# EAGLE schematic NinjaPCB-ver1.0 (EAGLE 6.6.0)
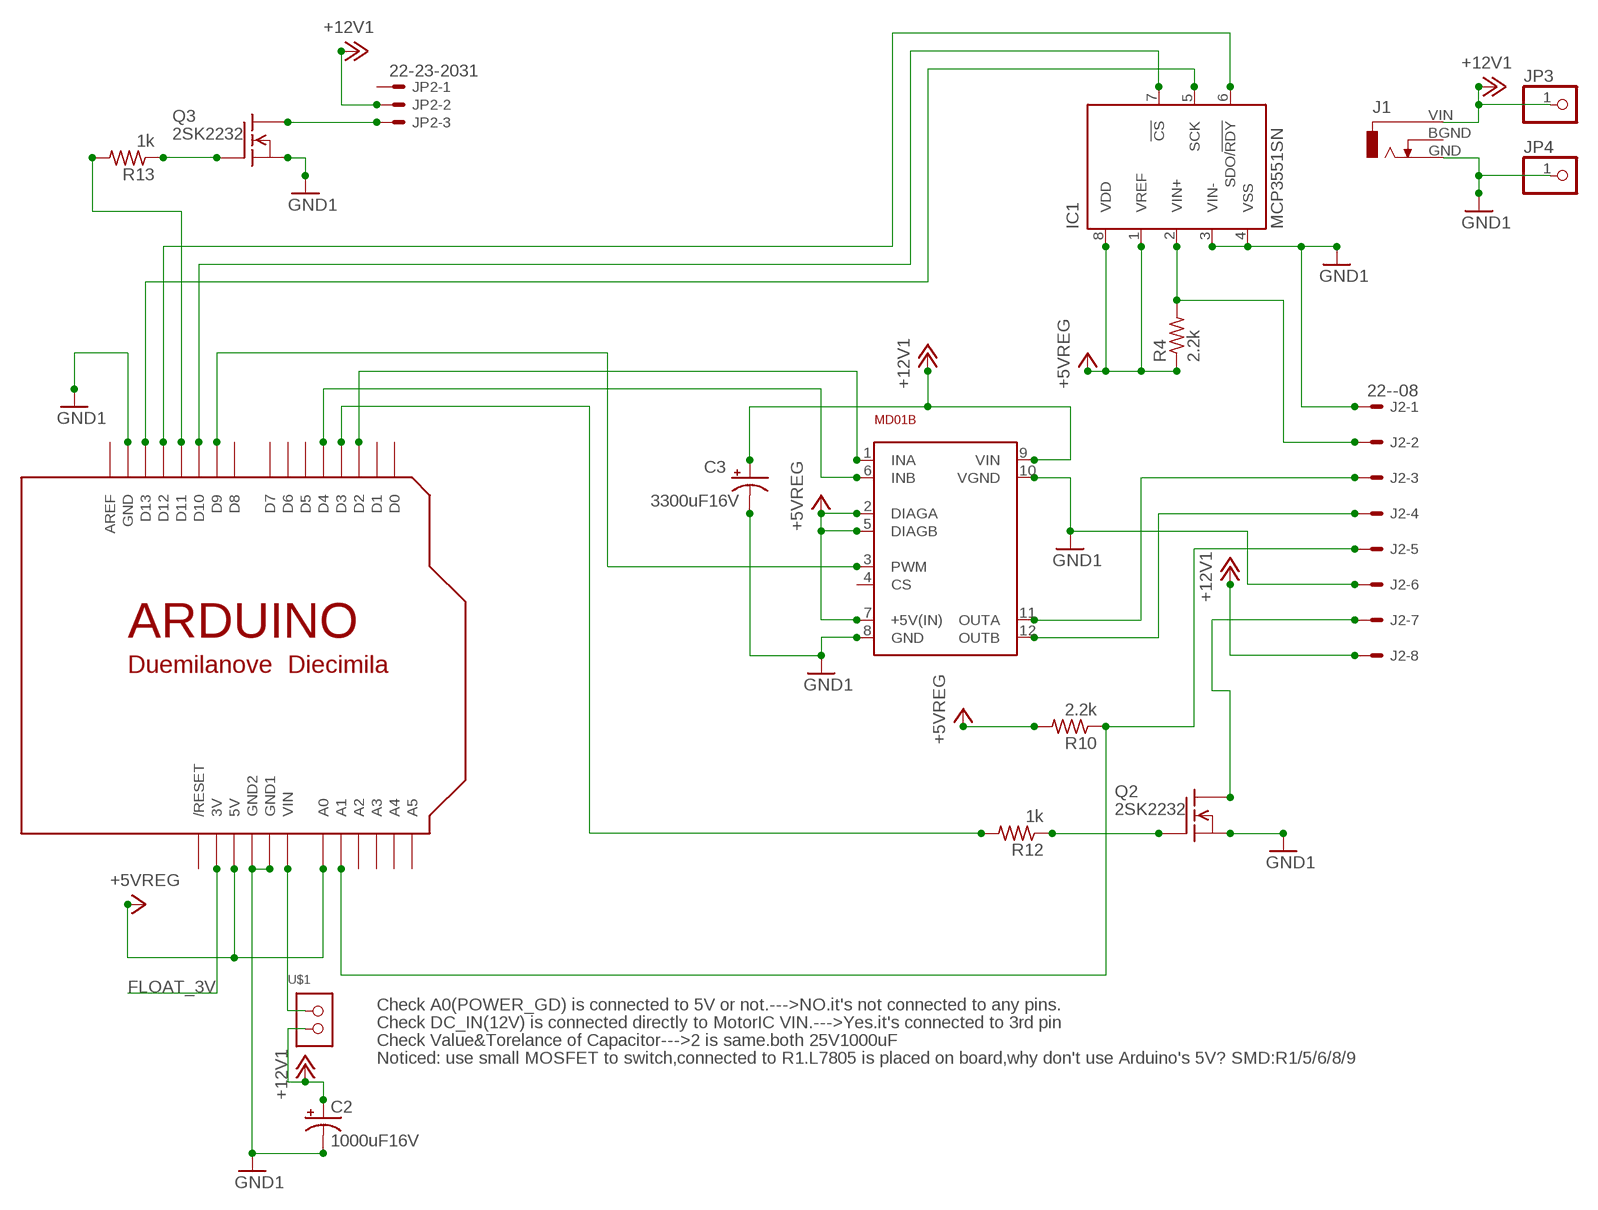
[diagram p0: schematic, sheet 1]

## Parts
C2  1000uF16V  CPOL-USE5-8.5  [E5-8,5]
C3  3300uF16V  CPOL-USE5-13  [E5-13]
IC1  MCP3551SN  [SO-08]
J1  DCJ0303  [DCJ0303]
J2  22--08  [POLOLU-8-VERTICAL]
JP2  22-23-2031  [22-23-2031]
JP3  PINHD-1X1  [1X01]
JP4  PINHD-1X1  [1X01]
MD01B  VNH3SP30+4PINN  [VNH3SP30+4PIN_NOHOLES]
Q2  2SK2232  BSS97  [TO202]
Q3  2SK2232  BSS97  [TO202]
R4  2.2k  R-US_0207/10  [0207/10]
R10  2.2k  R-US_0207/10  [0207/10]
R12  1k  R-US_0207/10  [0207/10]
R13  1k  R-US_0207/10  [0207/10]
U$1  1X02  [1X02_1.1_UNSIGNED]
U$3  Arduino UNO  ARDUINONS  [ARDUINO-NOSILK]

## Nets
+5VREG [2A]: IC1.1(VREF) IC1.8(VDD) MD01B.2(DIAGA) MD01B.5(DIAGB) MD01B.7(+5V(IN)) R4.1 R10.2 U$3.5V U$3.A0
+12V1 [8A]: C2.+ C3.+ J1.VIN J2.8 JP2.2 JP3.1 MD01B.9(VIN) U$1.2
D13: IC1.5(SCK) U$3.D13
FLOAT_3V: U$3.3V
GND1 [2A]: C2.- C3.- IC1.3(VIN-) IC1.4(VSS) J1.GND J2.1 J2.6 JP4.1 MD01B.8(GND) MD01B.10(VGND) Q2.1(S) Q3.1(S) U$3.GND U$3.GND1 U$3.GND2
N$1: JP2.3 Q3.2(D)
N$2: Q3.3(G) R13.1
N$3: R13.2 U$3.D11
N$5: U$1.1 U$3.VIN
N$8: R12.2 U$3.D3
N$18 [3A]: J2.7 Q2.2(D)
N$23: IC1.2(VIN+) J2.2 R4.2
N$27: IC1.6(SDO/!RDY) U$3.D12
N$29: IC1.7(!CS) U$3.D10
N$37: J2.5 R10.1 U$3.A1
OUTA: J2.3 MD01B.11(OUTA)
OUTB: J2.4 MD01B.12(OUTB)
S$1: MD01B.1(INA) U$3.D2
S$2: MD01B.3(PWM) U$3.D9
S$3: MD01B.6(INB) U$3.D4
T1: Q2.3(G) R12.1
Unconnected: J1.BGND JP2.1 MD01B.4(CS) U$3.A2 U$3.A3 U$3.A4 U$3.A5 U$3.AREF U$3.D0 U$3.D1 U$3.D5 U$3.D6 U$3.D7 U$3.D8 U$3.RESET(/RESET)

## Notes on the sheet
- Check A0(POWER_GD) is connected to 5V or not.--->NO.it's not connected to any pins.
- Check DC_IN(12V) is connected directly to MotorIC VIN.--->Yes.it's connected to 3rd pin
- Check Value&Torelance of Capacitor--->2 is same.both 25V1000uF
- Noticed: use small MOSFET to switch,connected to R1.L7805 is placed on board,why don't use Arduino's 5V? SMD:R1/5/6/8/9

## Library data of the parts
C2 C3 = rcl:CPOL-US: POLARIZED CAPACITOR, American symbol
IC1 = microchip:MCP355*: Low-Power, Single-Channel 22-Bit Delta-Sigma ADCs Source: http://ww1.microchip.com/downloads/en/DeviceDoc/21950c.pdf; MPN: MCP3551-E/SN; OC_FARNELL: 1084625; OC_NEWARK: 97K4494
J1 = JACK:DCJ0303: DC POWER JACK Source: DCJ0303.pdf; OC_FARNELL: unknown; OC_NEWARK: unknown
J2 = con-molex:22-?-08: CONNECTOR wire to board 2.54 mm (.1 inch) pitch header
JP2 = con-molex:22-23-2031: .100" (2.54mm) Center Header - 3 Pin; MF: MOLEX; MPN: 22-23-2031; OC_FARNELL: 1462950; OC_NEWARK: 30C0862
JP3 JP4 = pinhead:PINHD-1X1: PIN HEADER
MD01B = MOTORDRIVE:VNH3SP30+4PIN
Q2 Q3 = openpcr:BSS97: N-Channel Enhancement MOSFET 200V; 1.5A; 1,6Ohm
R4 R10 R12 R13 = resistor:R-US_: RESISTOR, American symbol
U$1 = PIN:1X02
U$3 = openpcr:ARDUINO: Arduino Diecimila/Duemilanove Make a shield with ease, this package has all the named pins as well as the two mounting drill holes and an outline of the USB and DC power connector. The outline is on the DIMENSION layer, so if your board house uses it they will cut the outline to match. http://www.ladyada.net/library/pcb/eaglelibrary.html

## Net classes
0 default: width 0.381 mm
1 2A: width 0.406 mm
2 8A: width 2.54 mm
3 3A: width 1.016 mm